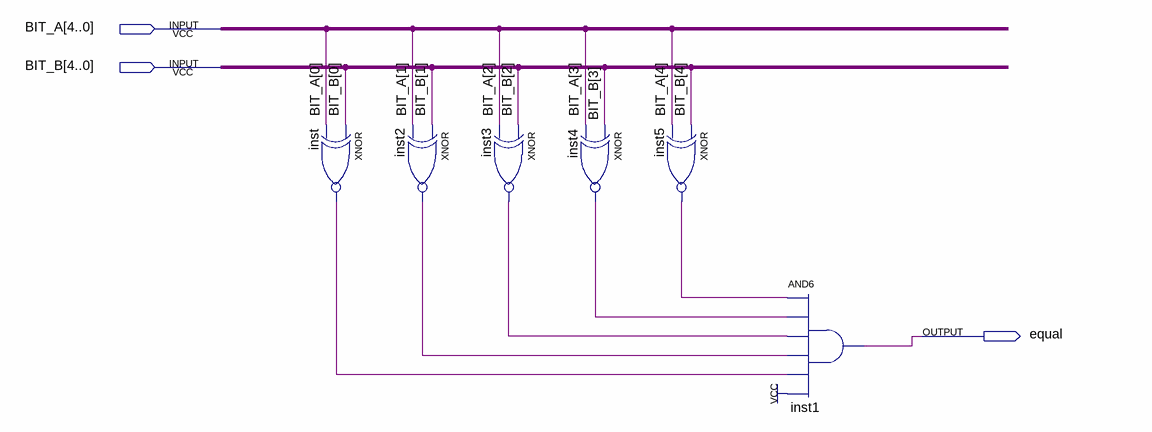
[diagram p0: schematic sheet]
// Quartus schematic equal.bdf as structural Verilog: 6 symbols, 3 pins
module equal (
  input  [4:0] BIT_A,
  input  [4:0] BIT_B,
  output equal
);

  wire inst2_out, inst3_out, inst4_out, inst5_out, inst_out;

  xnor inst (inst_out, BIT_B[0], BIT_A[0]);
  xnor inst2 (inst2_out, BIT_B[1], BIT_A[1]);
  xnor inst3 (inst3_out, BIT_B[2], BIT_A[2]);
  xnor inst4 (inst4_out, BIT_B[3], BIT_A[3]);
  xnor inst5 (inst5_out, BIT_B[4], BIT_A[4]);
  and inst1 (equal, inst5_out, inst4_out, inst3_out, inst2_out, inst_out, 1'b1);
endmodule
